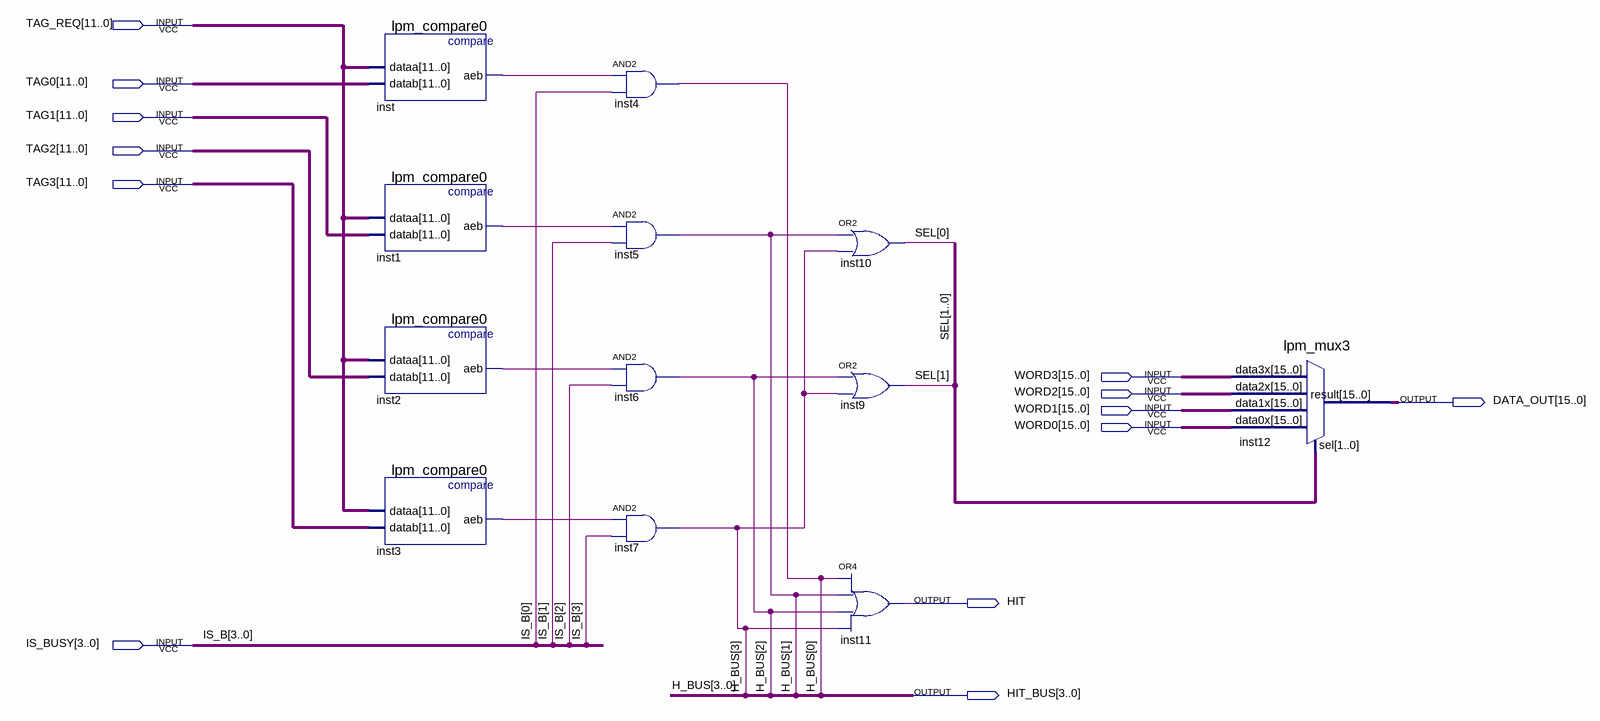
[diagram p0: schematic sheet]
// Quartus schematic Hit_Detection.bdf as structural Verilog: 12 symbols, 13 pins
module Hit_Detection (
  input  [11:0] TAG_REQ,
  input  [11:0] TAG0,
  input  [11:0] TAG1,
  input  [11:0] TAG2,
  input  [11:0] TAG3,
  input  [15:0] WORD3,
  input  [15:0] WORD2,
  input  [15:0] WORD1,
  input  [15:0] WORD0,
  input  [3:0] IS_BUSY,
  output [15:0] DATA_OUT,
  output HIT,
  output [3:0] HIT_BUS
);

  wire inst1_aeb, inst2_aeb, inst3_aeb, inst_aeb;
  wire [1:0] SEL;

  lpm_compare0 inst (.dataa(TAG_REQ), .datab(TAG0), .aeb(inst_aeb));
  lpm_compare0 inst1 (.dataa(TAG_REQ), .datab(TAG1), .aeb(inst1_aeb));
  lpm_compare0 inst2 (.dataa(TAG_REQ), .datab(TAG2), .aeb(inst2_aeb));
  lpm_compare0 inst3 (.dataa(TAG_REQ), .datab(TAG3), .aeb(inst3_aeb));
  and inst4 (HIT_BUS[0], inst_aeb, IS_BUSY[0]);
  and inst5 (HIT_BUS[1], inst1_aeb, IS_BUSY[1]);
  and inst6 (HIT_BUS[2], inst2_aeb, IS_BUSY[2]);
  and inst7 (HIT_BUS[3], inst3_aeb, IS_BUSY[3]);
  or inst10 (SEL[0], HIT_BUS[1], HIT_BUS[3]);
  or inst9 (SEL[1], HIT_BUS[2], HIT_BUS[3]);
  or inst11 (HIT, HIT_BUS[0], HIT_BUS[1], HIT_BUS[2], HIT_BUS[3]);
  lpm_mux3 inst12 (.data3x(WORD3), .data2x(WORD2), .data1x(WORD1), .data0x(WORD0), .sel(SEL), .result(DATA_OUT));

  // Other names for the same wires on the sheet: H_BUS[3:0] = HIT_BUS; IS_B[3:0] = IS_BUSY
endmodule
